# Altium schematic sheet PAGE1.SchDoc
size 297 x 209 mm; CompanyName: FPT-FTI copporation; Address1: FPT Building Duy Tan; Address2: Floor 4,; NameAuthor: Angle Vu
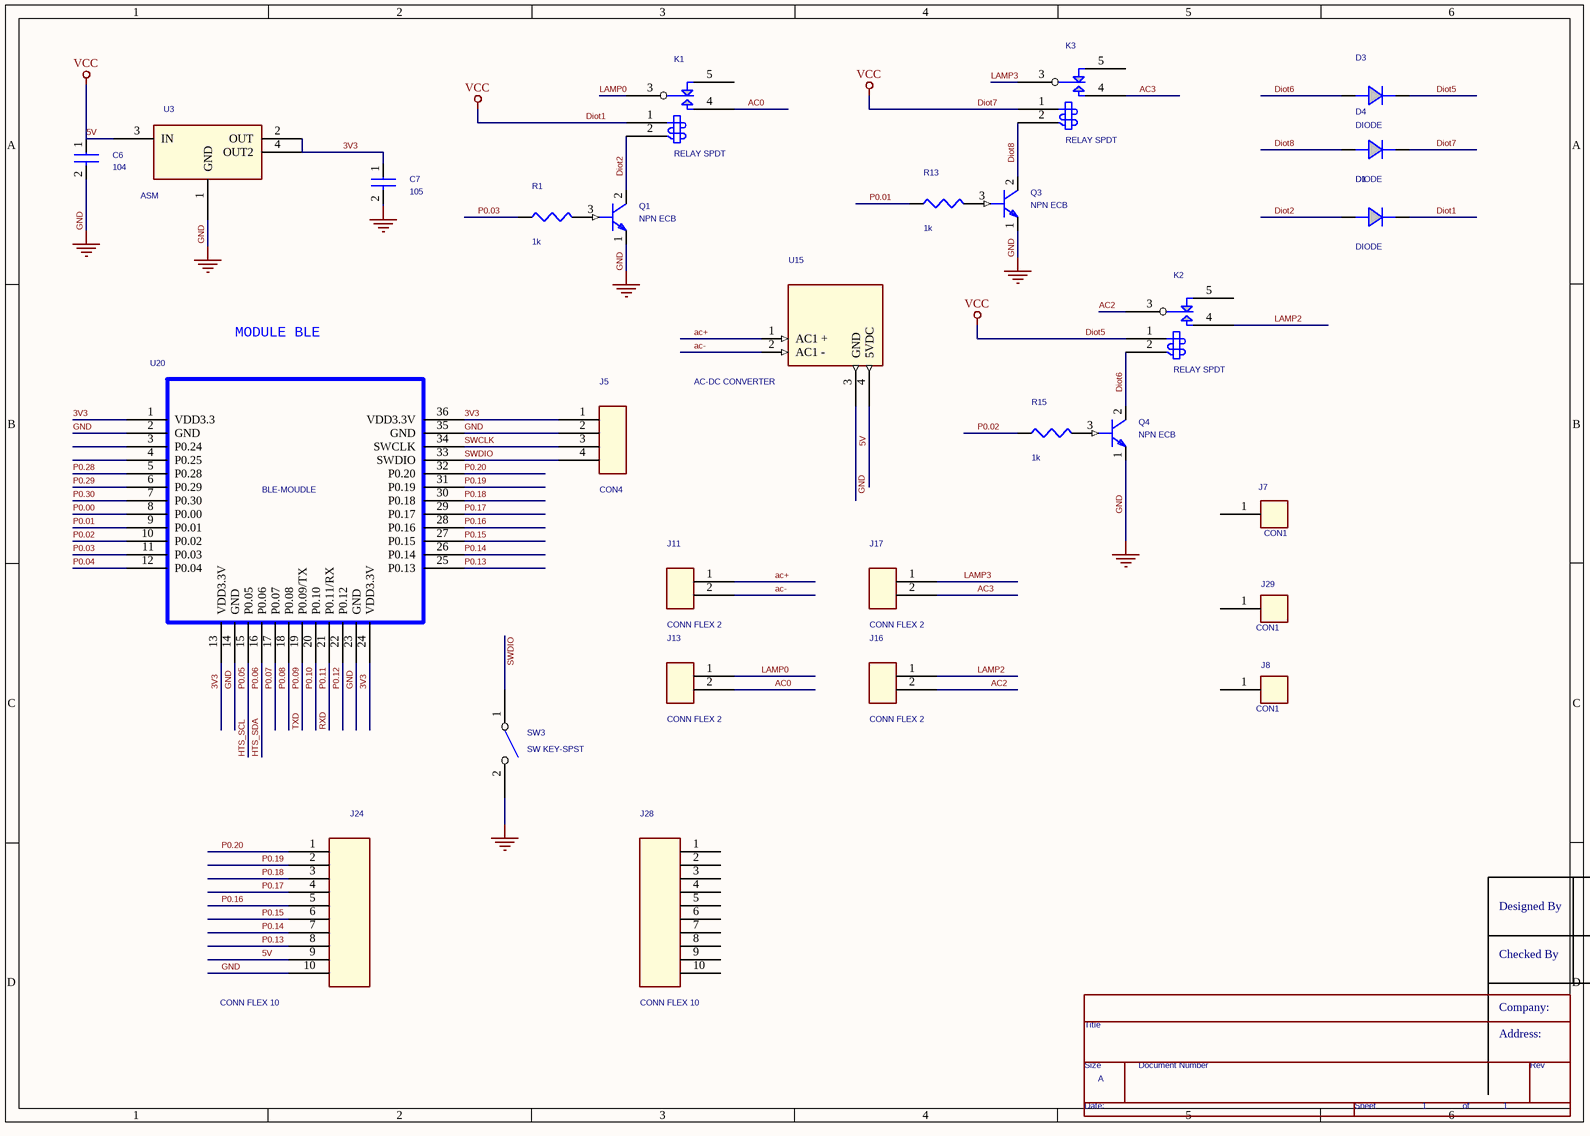
[diagram p0: PAGE1.SchDoc]

## Parts
*  Page Size: A  Page Number: 1  (hidden comment: TitleBlock0)  (graphical)
C6  104
C7  105
D1  DIODE
D3  DIODE
D4  DIODE
J5  CON4
J7  CON1
J8  CON1
J11  CONN FLEX 2
J13  CONN FLEX 2
J16  CONN FLEX 2
J17  CONN FLEX 2
J24  CONN FLEX 10
J28  CONN FLEX 10
J29  CON1
K1  RELAY SPDT
K2  RELAY SPDT
K3  RELAY SPDT
Q1  NPN ECB
Q3  NPN ECB
Q4  NPN ECB
R1  1k
R13  1k
R15  1k
SW3  SW KEY-SPST
U3  ASM
U15  AC-DC CONVERTER
U20  BLE-MOUDLE

## Nets
5V: C6.1 D1.1(K) D3.1(K) D4.1(K) J24.9 K1.1(COIL1) K2.1(COIL1) K3.1(COIL1) U3.3(IN) U15.4(5VDC)  [also labelled Diot1, Diot5, Diot7, VCC]
GND: C6.2 C7.2 J5.2 J24.10 Q1.1(EMITTER) Q3.1(EMITTER) Q4.1(EMITTER) SW3.2 U3.1(GND) U15.3(GND) U20.2(GND) U20.14(GND) U20.23(GND) U20.35(GND)
3V3: C7.1 J5.1 U3.2(OUT) U3.4(OUT2) U20.1(VDD3.3) U20.13(VDD3.3V) U20.24(VDD3.3V) U20.36(VDD3.3V)
AC0: J13.2 K1.4(NO)
AC2: J16.2 K2.3(COMMON)
AC3: J17.2 K3.4(NO)
ac+: J11.1 U15.1(AC1_+)
ac-: J11.2 U15.2(AC1_-)
Diot2: D1.2(A) K1.2(COIL2) Q1.2(COLLECTOR)
Diot6: D3.2(A) K2.2(COIL2) Q4.2(COLLECTOR)
Diot8: D4.2(A) K3.2(COIL2) Q3.2(COLLECTOR)
HTS_SCL: U20.15(P0.05)  [also labelled P0.05]
HTS_SDA: U20.16(P0.06)  [also labelled P0.06]
LAMP0: J13.1 K1.3(COMMON)
LAMP2: J16.1 K2.4(NO)
LAMP3: J17.1 K3.3(COMMON)
P0.00: U20.8(P0.00)
P0.01: R13.1 U20.9(P0.01)
P0.02: R15.1 U20.10(P0.02)
P0.03: R1.1 U20.11(P0.03)
P0.04: U20.12(P0.04)
P0.07: U20.17(P0.07)
P0.08: U20.18(P0.08)
P0.09: U20.19(P0.09/TX)  [also labelled TXD]
P0.10: U20.20(P0.10)
P0.11: U20.21(P0.11/RX)  [also labelled RXD]
P0.12: U20.22(P0.12)
P0.13: J24.8 U20.25(P0.13)
P0.14: J24.7 U20.26(P0.14)
P0.15: J24.6 U20.27(P0.15)
P0.16: J24.5 U20.28(P0.16)
P0.17: J24.4 U20.29(P0.17)
P0.18: J24.3 U20.30(P0.18)
P0.19: J24.2 U20.31(P0.19)
P0.20: J24.1 U20.32(P0.20)
P0.28: U20.5(P0.28)
P0.29: U20.6(P0.29)
P0.30: U20.7(P0.30)
SWCLK: J5.3 U20.34(SWCLK)
SWDIO: J5.4 SW3.1 U20.33(SWDIO)
NetQ1_3: Q1.3(BASE) R1.2
NetQ3_3: Q3.3(BASE) R13.2
NetQ4_3: Q4.3(BASE) R15.2

Not connected (* = marked no-connect by the designer): J7 1; J8 1; J28 1 2 3 4 5 6 7 8 9 10; J29 1; K1 5(NC); K2 5(NC); K3 5(NC); U20 3(P0.24) 4(P0.25)

## Notes on the sheet
- MODULE BLE
- Designed By
- Checked By
- Company:
- Size:
- A3
- Address:
- Sheet:
- /
- (in symbol TitleBlock0) Title; Size; Document Number; Rev; Date:; Sheet; of

## Library data of the parts
C6 C7 = CAP NP_Dup1
Q1 Q3 Q4 = NPN ECB_1
R1 R13 R15 = R
U3 = LM1117-3v3
U15 = AA05AS/MOD_4
U20 = BLE-MOUDLE_1
* = TitleBlock0: Page Create Date: March  8, 1995; Page Count: 1